# Altium schematic sheet Bluetooth.SchDoc
size A4
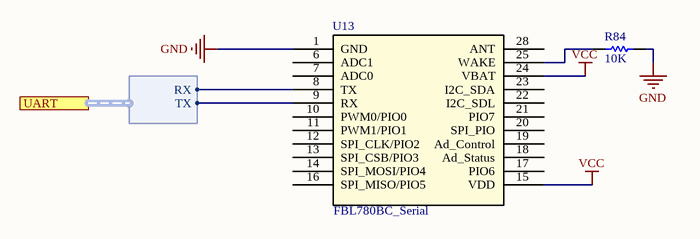
[diagram p0: Bluetooth.SchDoc]

## Parts
R84  value 10K  [R0603[1608]]  (hidden comment: 10K 1% 0603)
U13  FBL780BC_Serial  [FBL780BC_Serial]

## Ports
UART (harness USART2)

## Harnesses
USART2: TX, RX

## Nets
GND: R84.2 U13.1(GND)
VCC: U13.15(VDD) U13.24(VBAT)
NetR84_1: R84.1 U13.25(WAKE)
NetU13_8: U13.8(TX) ; port UART.RX
NetU13_9: U13.9(RX) ; port UART.TX

Not connected (* = marked no-connect by the designer): U13 6(ADC1) 7(ADC0) 10(PWM0/PIO0) 11(PWM1/PIO1) 12(SPI_CLK/PIO2) 13(SPI_CSB/PIO3) 14(SPI_MOSI/PIO4) 16(SPI_MISO/PIO5) 17(PIO6) 18(Ad_Status) 19(Ad_Control) 20(SPI_PIO) 21(PIO7) 22(I2C_SDL) 23(I2C_SDA) 28(ANT)

## Library data of the parts
R84 = RES_10K_0603_1%: 10K 0.25W 1% 0603 (1005 Metric); Manufacturer: Vishay / Dale; PartNumber: CRCW060310K0FKEAHP; Tolerance: 1%; Power: 0.25W; Mounting Technology: Surface Mount; PackageReference: 0603; PackageDescription: 0603 (1608 Metric); ComponentLink1Description: Datasheet; ComponentLink1URL: http://www.vishay.com/docs/20065/rcse3.pdf
U13 = FBL780BC_Serial: Manufacturer: Firmtech; PartNumber: FBL780BC_Serial